# EAGLE design rainbow-gizmo-v2.0 (EAGLE 9.6.2)
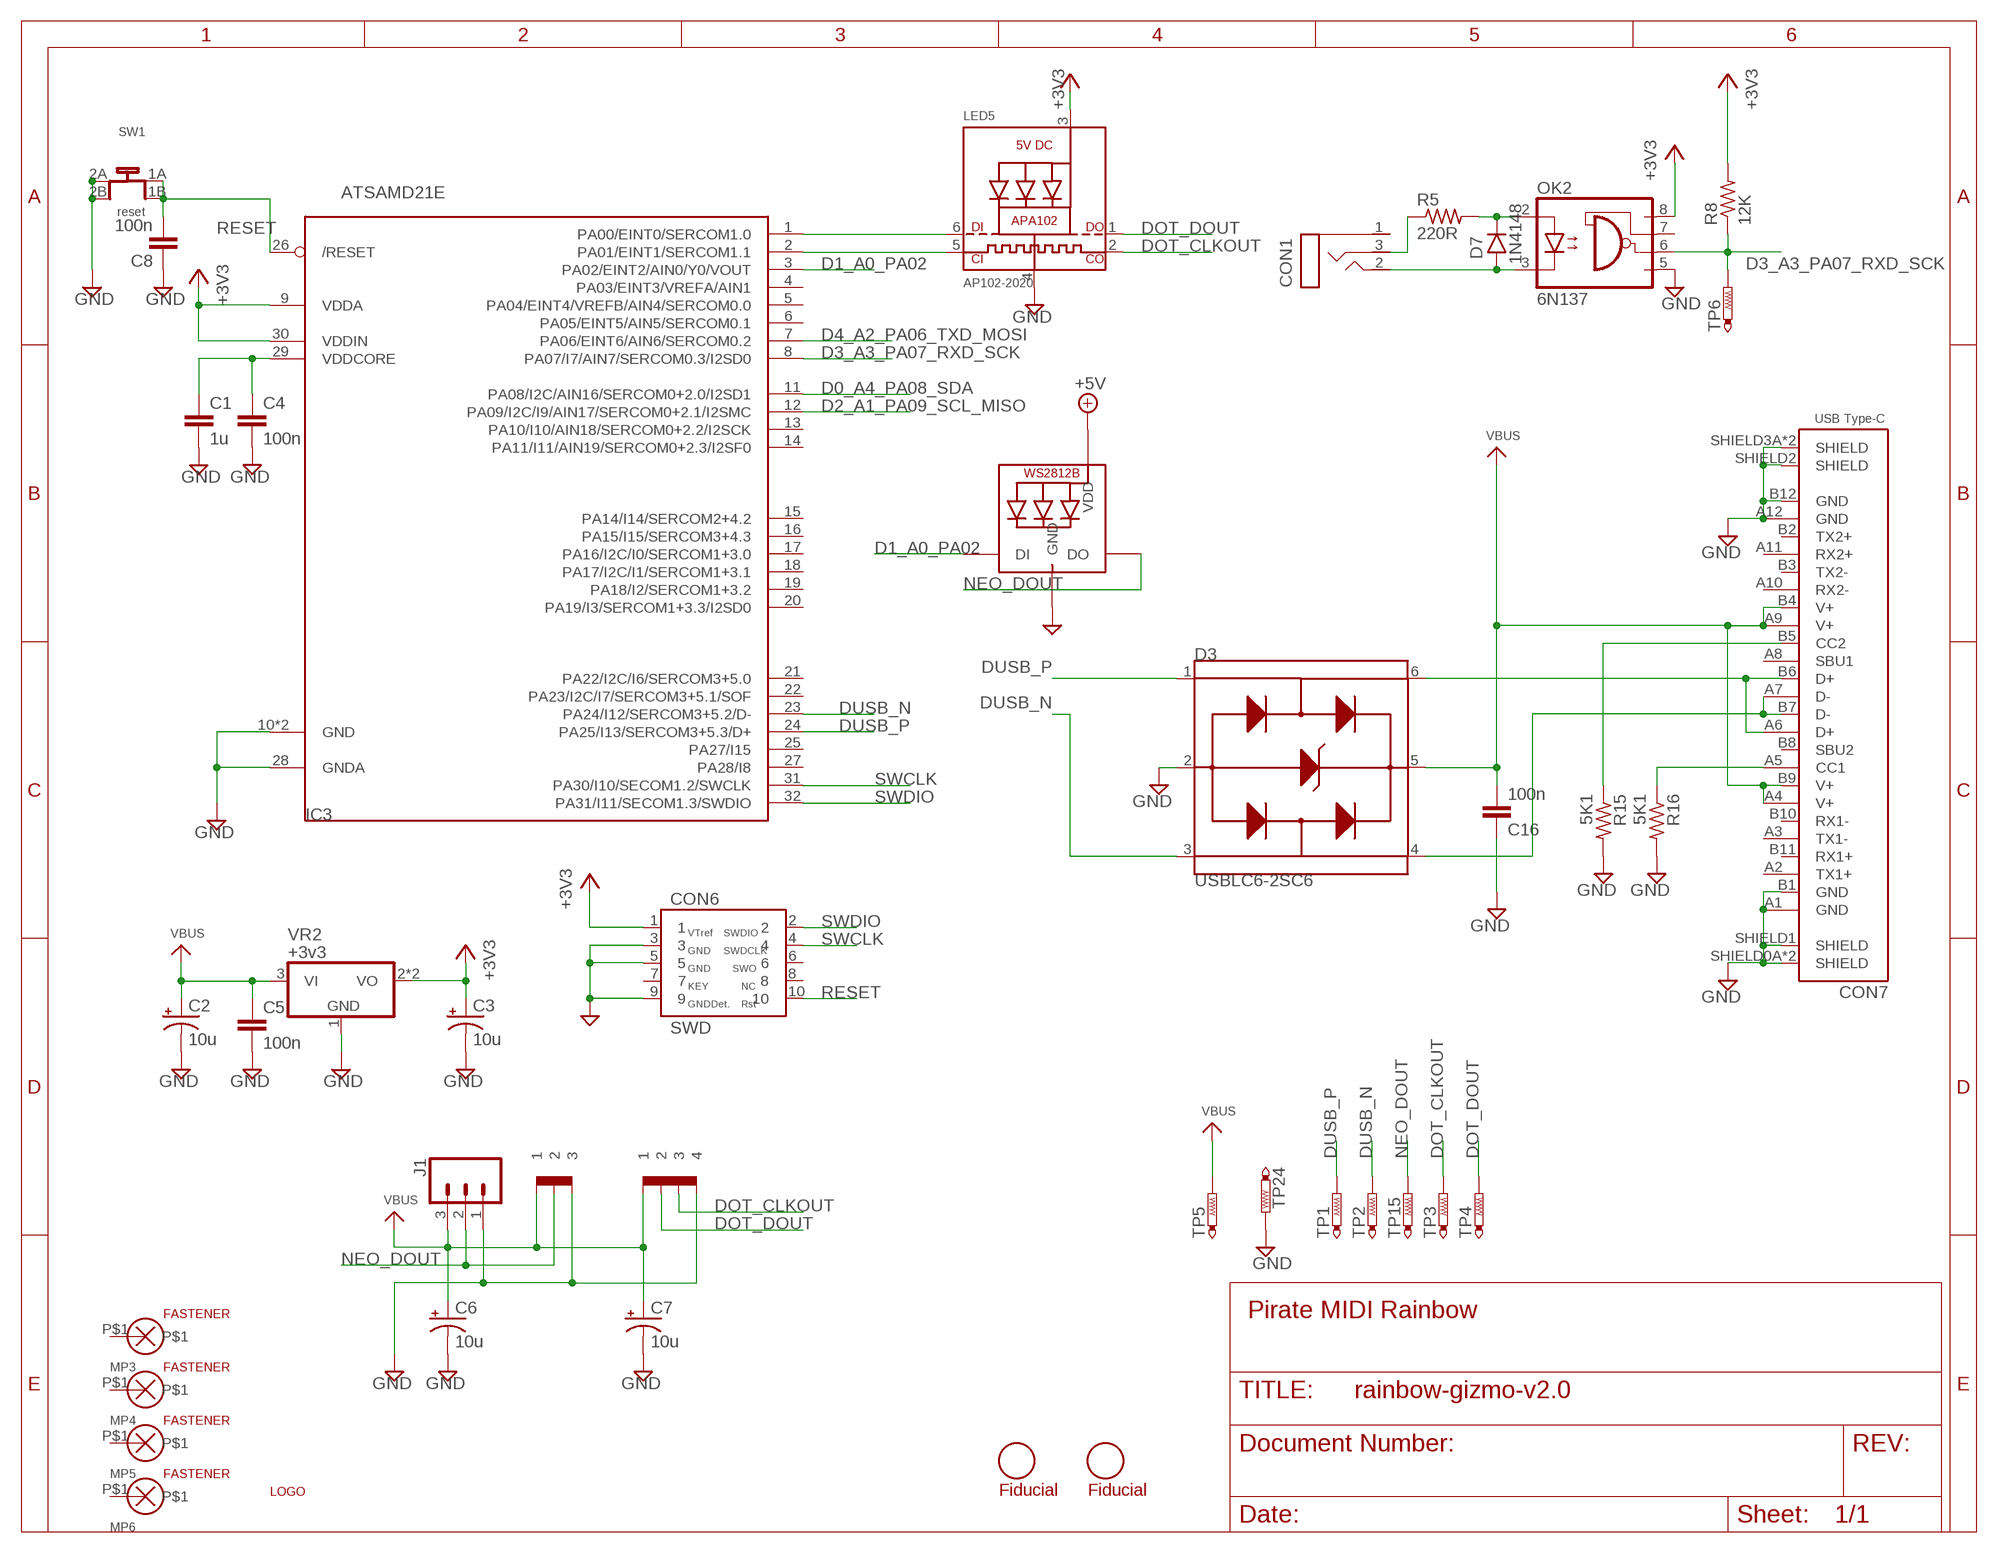
[diagram p0: schematic, sheet 1]

## Parts
C1  1u  SMD-NP0603-1U-H  [0603_CAP]
C2  10u  SMD-ELECTROLYTICB_10U  [PANASONIC_B]
C3  10u  SMD-ELECTROLYTICB_10U  [PANASONIC_B]
C4  100n  SMD-NP0603-100N-H  [0603_CAP]
C5  100n  SMD-NP0603-100N-H  [0603_CAP]
C6  10u  SMD-ELECTROLYTICB_10U  [PANASONIC_B]
C7  10u  SMD-ELECTROLYTICB_10U  [PANASONIC_B]
C8  100n  SMD-NP0603-100N-H  [0603_CAP]
C16  100n  SMD-NP0603-100N-H  [0603_CAP]
CON1  TRS3.5MM  [SJ-352*-SMT]
CON2  1X3PADS  [1X3_PADS]
CON4  1X4  [1X4_PADS]
CON6  SWD  SWD_CONNECTORSMD  [5X2_1.27MM_SMD]
CON7  DUAL SMT  USB_TYPE-CAMPHENOL  [10137064-00021LF]
D3  USBLC6-2SC6  [SOT95P280X145-6N]
D7  1N4148  [SOD-323]
FD3  FIDUCIALSQUARE_1MM  [FIDUCIAL_SQUARE_1MM]
FD4  FIDUCIALROUND_1MM  [FIDUCIAL_ROUND_1MM]
IC3  ATSAMD21E  [QFN32_5MM]
J1  1X3PH  [JST_S3B-PH-SM4-TB]
LED1  WS2812B2020  [LED2020RGB]
LED5  AP102-2020  APA1022020  [APA102_2020]
MP3  SCREW-FASTENER2.5  [M2.5-PANHEAD-VIA]
MP4  SCREW-FASTENER2.5  [M2.5-PANHEAD-VIA]
MP5  SCREW-FASTENER2.5  [M2.5-PANHEAD-VIA]
MP6  SCREW-FASTENER2.5  [M2.5-PANHEAD-VIA]
OK2  6N137  6N137S  [SMD8]
R5  220R  US0603-220R  [0603-RES]
R8  12K  US0603-12K  [0603-RES]
R15  5K1  US0603-5K1  [0603-RES]
R16  5K1  US0603-5K1  [0603-RES]
SW1  reset  MOMENTARYKRM_X  [KMR_X]
TP1  PTR1B1,27  [B1,27]
TP2  PTR1B1,27  [B1,27]
TP3  PTR1B1,27  [B1,27]
TP4  PTR1B1,27  [B1,27]
TP5  PTR1B1,27  [B1,27]
TP6  PTR1B1,27  [B1,27]
TP15  PTR1B1,27  [B1,27]
TP24  PTR1B1,27  [B1,27]
U$5  PM_LOGOSSTOP_M  [PM_M_MAIN_LOGO1_STOP]
VR2  +3v3  LD1117  [SOT223]

## Nets
+3V3: C3.+ CON6.1 IC3.9(VDDA) IC3.30(VDDIN) LED5.3(VDD) OK2.8(VCC) R8.2 VR2.2(VO) VR2.4(VO)
+5V: LED1.4(VDD)
A3: IC3.1(PA00/EINT0/SERCOM1.0) LED5.6(DI)
CC1: CON7.A5(CC1) R16.1
CC2: CON7.B5(CC2) R15.1
D0_A4_PA08_SDA: IC3.11(PA08/I2C/AIN16/SERCOM0+2.0/I2SD1)
D1_A0_PA02: IC3.3(PA02/EINT2/AIN0/Y0/VOUT) LED1.3(DI)
D2_A1_PA09_SCL_MISO: IC3.12(PA09/I2C/I9/AIN17/SERCOM0+2.1/I2SMC)
D3_A3_PA07_RXD_SCK: IC3.8(PA07/I7/AIN7/SERCOM0.3/I2SD0) OK2.6(VO) R8.1 TP6.TP
D4_A2_PA06_TXD_MOSI: IC3.7(PA06/EINT6/AIN6/SERCOM0.2)
DOT_CLKOUT: CON4.P$3 LED5.2(CKO) TP3.TP
DOT_DOUT: CON4.P$2 LED5.1(DO) TP4.TP
DUSB_N [diff pairs]: D3.3(I/O2) IC3.23(PA24/I12/SERCOM3+5.2/D-) TP2.TP
DUSB_P [diff pairs]: D3.1(I/O1) IC3.24(PA25/I13/SERCOM3+5.3/D+) TP1.TP
GND: C1.2 C2.- C3.- C4.2 C5.2 C6.- C7.- C8.1 C16.1 CON2.P$3 CON4.P$4 CON6.3 CON6.5 CON6.9 CON7.A1(GND) CON7.A12(GND) CON7.B1(GND) CON7.B12(GND) CON7.SHIELD0A(SHIELD) CON7.SHIELD0B(SHIELD) CON7.SHIELD1(SHIELD) CON7.SHIELD2(SHIELD) CON7.SHIELD3A(SHIELD) CON7.SHIELD3B(SHIELD) D3.2(GND) IC3.10(GND) IC3.28(GNDA) IC3.33(GND) J1.1 LED1.2(GND) LED5.4(GND) OK2.5(GND) R15.2 R16.2 SW1.2A SW1.2B TP24.TP VR2.1(GND)
N$7: CON1.2(T) D7.A OK2.3(C)
N$8: IC3.2(PA01/EINT1/SERCOM1.1) LED5.5(CKI)
N$9: D7.C OK2.2(A) R5.2
N$10: CON1.3(R) R5.1
N$30: CON7.A6(D+) CON7.B6(D+) D3.6(I/O3)
N$31: CON7.A7(D-) CON7.B7(D-) D3.4(I/O4)
NEO_DOUT: CON2.P$2 J1.2 LED1.1(DO) TP15.TP
RESET: C8.2 CON6.10 IC3.26(/RESET) SW1.1A SW1.1B
SWCLK: CON6.4 IC3.31(PA30/I10/SECOM1.2/SWCLK)
SWDIO: CON6.2 IC3.32(PA31/I11/SECOM1.3/SWDIO)
VBUS: C2.+ C5.1 C6.+ C7.+ C16.2 CON2.P$1 CON4.P$1 CON7.A4(V+) CON7.A9(V+) CON7.B4(V+) CON7.B9(V+) D3.5(VBUS) J1.3 TP5.TP VR2.3(VI)
VDDCORE1: C1.1 C4.1 IC3.29(VDDCORE)
Unconnected: CON1.1(S) CON6.6 CON6.7 CON6.8 CON7.A2(TX1+) CON7.A3(TX1-) CON7.A8(SBU1) CON7.A10(RX2-) CON7.A11(RX2+) CON7.B2(TX2+) CON7.B3(TX2-) CON7.B8(SBU2) CON7.B10(RX1-) CON7.B11(RX1+) IC3.4(PA03/EINT3/VREFA/AIN1) IC3.5(PA04/EINT4/VREFB/AIN4/SERCOM0.0) IC3.6(PA05/EINT5/AIN5/SERCOM0.1) IC3.13(PA10/I10/AIN18/SERCOM0+2.2/I2SCK) IC3.14(PA11/I11/AIN19/SERCOM0+2.3/I2SF0) IC3.15(PA14/I14/SERCOM2+4.2) IC3.16(PA15/I15/SERCOM3+4.3) IC3.17(PA16/I2C/I0/SERCOM1+3.0) IC3.18(PA17/I2C/I1/SERCOM1+3.1) IC3.19(PA18/I2/SERCOM1+3.2) IC3.20(PA19/I3/SERCOM1+3.3/I2SD0) IC3.21(PA22/I2C/I6/SERCOM3+5.0) IC3.22(PA23/I2C/I7/SERCOM3+5.1/SOF) IC3.25(PA27/I15) IC3.27(PA28/I8) MP3.P$1 MP4.P$1 MP5.P$1 MP6.P$1 OK2.7(VE)

## Notes on the sheet
- Pirate MIDI Rainbow

## Library data of the parts
C1 = SPENCER Capacitors:SMD-NP: General usage non-polarized capacitors. House parts are denoted with suffic 'H'.; DIELECTRIC: X5R; MANUFACTURER: YAGEO; PART_NO: CC0603KRX5R8BB105; SUPPLIER: MOUSER; TOLERANCE: 10%; VOLTAGE: 25V
C2 C3 C6 C7 = SPENCER Capacitors:SMD-ELECTROLYTIC; MANUFACTURER: PANASONIC; PART_NO: EEE-HB1E100AR; SUPPLIER: MOUSER
C4 C5 C8 C16 = SPENCER Capacitors:SMD-NP: General usage non-polarized capacitors. House parts are denoted with suffic 'H'.; DIELECTRIC: X7R; MANUFACTURER: TDK; PART_NO: CGA3E2X7R1H104K080AA; SUPPLIER: MOUSER; TOLERANCE: 10%; VOLTAGE: 50V
CON1 = SPENCER Connectors:TRS; MANUFACTURER: CUI; PART_NO: SJ-3523-SMT-TR; SUPPLIER: MOUSER
CON2 = SPENCER. Headers:1X3: Header pins suitable for both male and female headers with 0.1" pin spacing.
CON4 = SPENCER. Headers:1X4: Header pins suitable for both male and female headers with 0.1" pin spacing.
CON6 = SPENCER Connectors:SWD_CONNECTOR; MANUFACTURER: HARWIN; PART_NO: M50-3600542R; SUPPLIER: MOUSER
CON7 = SPENCER Connectors:USB_TYPE-C: JAE DX07S024JJ2 USB Type-C Connector ***Footprint contains plated drill holes (2mm diameter) instead of plated slots (easier on fabhouse)*** Technical Specifications: Mating cycles: 10,000 times Contact resistance: 40mΩ (max.) Rated current: 1.25A (max.) on pins A1, A4, A9, A12, B1, B4, B5, B9 and B12 0.25A (max.) on others Rated voltage: 20Vrms Datasheet <https://www.jae.com/z-en/pdf_download_exec.cfm?param=MB-0297-3E_DX07.pdf> Digi-Key part #: 670-2794-6-ND <http://www.digikey.com/product-detail/en/jae-electronics/DX07S024JJ2R1300/670-2794-6-ND/5246069> Mouser part #: 656-DX07S024JJ2R1300 <http://ca.mouser.com/ProductDetail/JAE-Electronics/DX07S024JJ2R1300/?qs=%2fha2pyFaduhsAyGD7ZqdDeHjVi4g0c8wrw%252bV08Os%252brQ5DqW1EY3Lew%3d%3d> Manufacturer part #: DX07S024JJ2R1300; MANUFACTURER: AMPHENOL FCI; PART_NO: 10137064-00021LF; SUPPLIER: MOUSER
D3 = SPENCER. diodes:USBLC6-2SC6: USBLC6 Series 2 Line 6 V Uni / Bi-Directional ESD Protection - SOT-23-6; MANUFACTURER: STMICROELECTRONICS; PART_NO: USBLC6-2SC6; SUPPLIER: MOUSER
D7 = SPENCER. diodes:1N4148: Fast Switching Diode DO-35 glass case a.k.a. 1N914; MANUFACTURER: MICRO COMMERCIAL COMPONENTS; PART_NO: 1N4148WX-TP; SUPPLIER: MOUSER
FD3 FD4 = SPENCER miscellaneous:FIDUCIAL
IC3 = microbuilder:ATSAMD21E
J1 = SPENCER Connectors:1X3: Multi connection point. Often used as Generic Header-pin footprint for 0.1 inch spaced/style header connections On any of the 0.1 inch spaced packages, you can populate with these: Break Away Headers - Straight <https://www.sparkfun.com/products/116> (PRT-00116) Break Away Male Headers - Right Angle <https://www.sparkfun.com/products/553> (PRT-00553) Female Headers <https://www.sparkfun.com/products/115> (PRT-00115) Break Away Headers - Machine Pin <https://www.sparkfun.com/products/117> (PRT-00117) Break Away Female Headers - Swiss Machine Pin <https://www.sparkfun.com/products/743> (PRT-00743) Stackable Header - 3 Pin (Female, 0.1") <https://www.sparkfun.com/products/13875> (PRT-13875) For SCREWTERMINALS and SPRING TERMINALS visit here: Screw Terimnals on SparkFun.com <https://www.sparkfun.com/search/results?term=Screw+Terminals> (5mm/3.5mm/2.54mm spacing) This device is also useful as a general connection point to wire up your design to another part of your project. Our various solder wires solder well into these plated through hole pads. Hook-Up Wire - Assortment (Stranded, 22 AWG) <https://www.sparkfun.com/products/11375> (PRT-11375) Hook-Up Wire - Assortment (Solid Core, 22 AWG) <https://www.sparkfun.com/products/11367> (PRT-11367) View the entire wire category on our website here <https://www.sparkfun.com/categories/141> Special notes: Molex polarized connector foot print use with SKU : PRT-08232 with associated crimp pins and housings.
LED1 = SPENCER. diodes:WS2812B; MANUFACTURER: WORLDSEMI; PART_NO: WS2812B-2020; SUPPLIER: TME
LED5 = SPENCER. diodes:APA102: APA102/DotStar Pixels VCC: 5V DC Refresh Rate: 400Hz
MP3-MP6 = SPENCER miscellaneous:SCREW-FASTENER
OK2 = SPENCER. ics:6N137: MOTOROLA OPTO COUPLER; MANUFACTURER: LITE-ON; PART_NO: 6N137S; SUPPLIER: MOUSER
R5 = SPENCER. resistors:US: Standard resistor package for most 1/4W (6mm) resistors. Suitable for both carbon and metal film type resistors. Package layouts vary between 1-6 0.1" hole spacings.; MANUFACTURER: YAGEO; PART_NO: RC0603FR-07220RL; SUPPLIER: MOUSER
R8 = SPENCER. resistors:US: Standard resistor package for most 1/4W (6mm) resistors. Suitable for both carbon and metal film type resistors. Package layouts vary between 1-6 0.1" hole spacings.; MANUFACTURER: YAGEO; PART_NO: RC0603FR-0712KL; SUPPLIER: MOUSER
R15 R16 = SPENCER. resistors:US: Standard resistor package for most 1/4W (6mm) resistors. Suitable for both carbon and metal film type resistors. Package layouts vary between 1-6 0.1" hole spacings.; MANUFACTURER: YAGEO; PART_NO: RC0603FR-075K1L; SUPPLIER: MOUSER
SW1 = SPENCER. Switches:MOMENTARY: Tactile push buttons used in millions of devices. Pins 1 and 2 are always connected, and pins 3 and 4 are always connected. Switching occurs between 1/2 and 3/4.; MANUFACTURER: C&K; PART_NO: KMR621NGLFS; SUPPLIER: MOUSER
TP1-TP6 TP15 TP24 = SPENCER testpad:PTR1: TEST PIN
U$5 = SPENCER logos:PM_LOGOS
VR2 = SPENCER. regulators_converters:LD1117; MANUFACTURER: STMICROELECTRONICS; PART_NO: LD1117S33CTR; SUPPLIER: MOUSER

## Net classes
1 differential: width 0.203 mm
2 diff pairs: width 0.203 mm

## Board
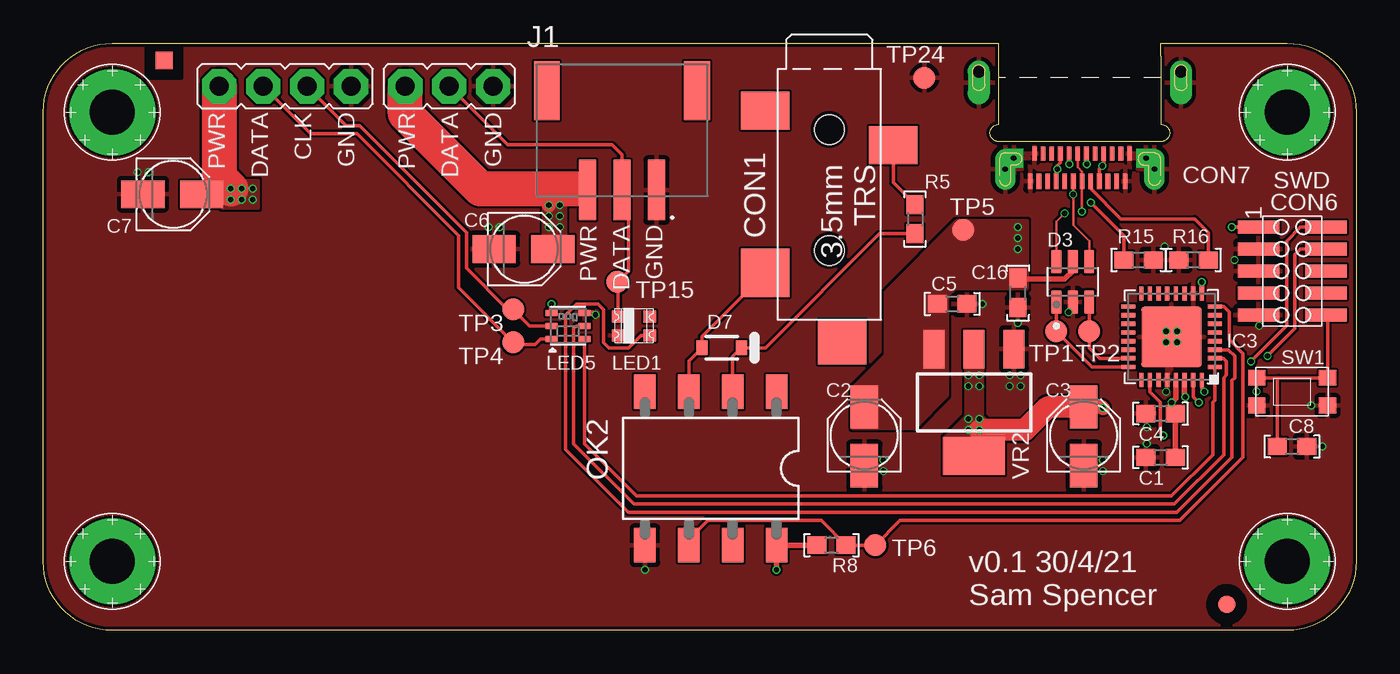
[diagram p1: board, top side]
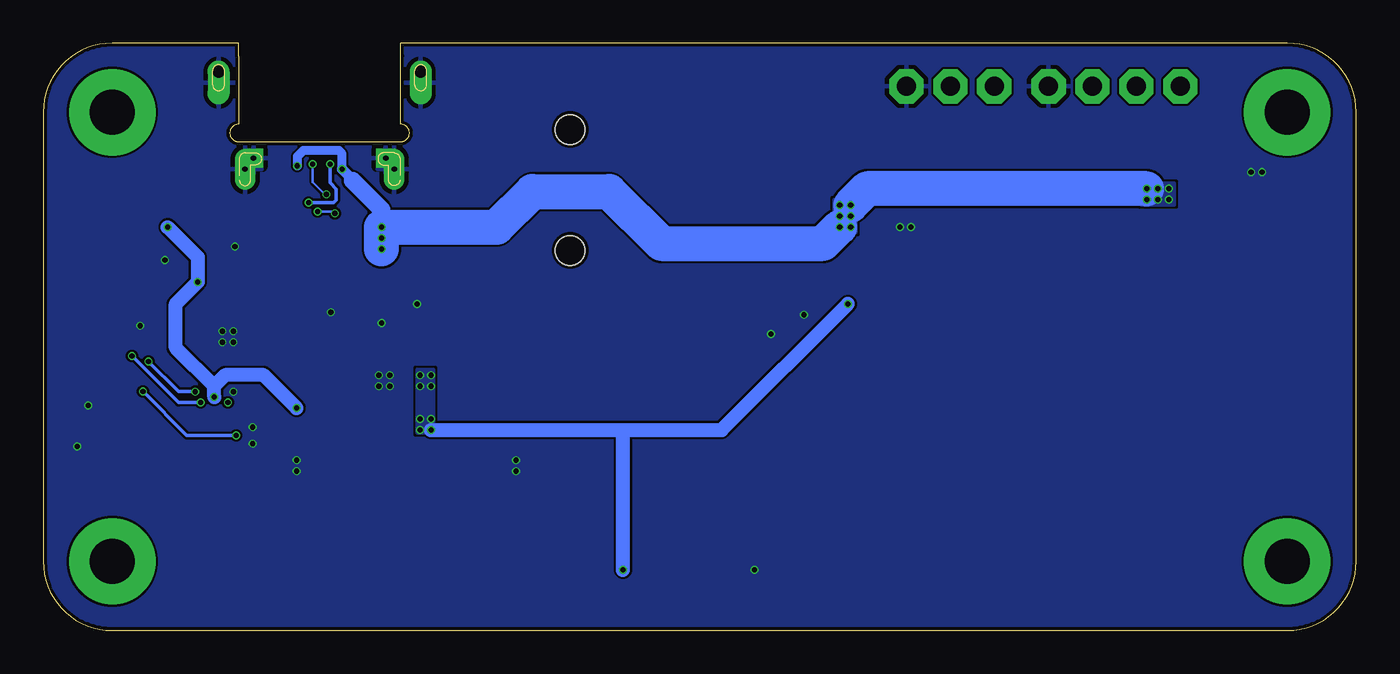
[diagram p2: board, bottom side, seen from below]

Size 76 x 34 mm. Coordinates in mm from the lower left corner, seen from the top.
Outline: 55.3,33.25 55.3,34 4,34 arc90 0,30 0,4 arc90 4,0 72,0 arc90 76,4 76,30 arc90 72,34 64.7,34 64.7,33.25
Copper layers (1*16): Top 0.035mm / dielectric 1.6mm / Bottom 0.035mm
Design rules "jlcpcb-2layers-new *": minimum track width 5mil, minimum drill 0.3mm, track to track 5mil, track to pad 5mil, pad to pad 5mil, via to via 5mil, smd to smd 0mil, copper to edge 0.2mm, drill to drill 6mil, minimum pad ring 10mil, minimum via ring 3mil, stop-mask expansion 4mil, vias tented up to drill 0mil, thermal gap 10mil

### Footprints (pad centres in the part's own frame; a part is rotated, then mirrored left to right if it is on the bottom)
0603_CAP = smd 1.1 x 1: 1 -0.85,0; 2 0.85,0
PANASONIC_B = smd 2.5 x 1.6: + 1.65,0; - -1.75,0
SJ-352*-SMT = smd 2.2 x 2.8: 1 -4.1,-3.7; 3 -2.1,3.7 | smd 2.8 x 2.8: 2 5.3,-3.7 | smd 2.6 x 2.8: 4 9.3,0.75 | hole 1.7: -3,0; 4,0
1X3_PADS = drill 1.1 octagon: P$1 -2.54,0; P$2 0,0; P$3 2.54,0
1X4_PADS = drill 1.1 octagon: P$1 -3.81,0; P$2 -1.27,0; P$3 1.27,0; P$4 3.81,0
5X2_1.27MM_SMD = smd 0.75 x 2.4: 1 -2.54,-1.95; 2 -2.54,1.95; 3 -1.27,-1.95; 4 -1.27,1.95; 5 0,-1.95; 6 0,1.95; 7 1.27,-1.95; 8 1.27,1.95; 9 2.54,-1.95; 10 2.54,1.95
10137064-00021LF = smd 0.27 x 0.9: A1 -2.625,5.995; A2 -2.125,5.995; A3 -1.625,5.995; A4 -1.125,5.995; A5 -0.625,5.995; A6 -0.125,5.995; A7 0.375,5.995; A8 0.875,5.995; A9 1.375,5.995; A10 1.875,5.995; A11 2.375,5.995; A12 2.875,5.995 | smd 0.27 x 0.8: B1 2.625,4.4; B2 2.125,4.4; B3 1.625,4.4; B4 1.125,4.4; B5 0.625,4.4; B6 0.125,4.4; B7 -0.375,4.4; B8 -0.875,4.4; B9 -1.375,4.4; B10 -1.875,4.4; B11 -2.375,4.4; B12 -2.875,4.4 | drill 0.3 pad 1.2 long: SHIELD0A -4.32,5.3; SHIELD3A 4.32,5.3 | drill 0.3 pad 1.1 square: SHIELD0B -3.83,4.65; SHIELD3B 3.83,4.65 | drill 0.7 offset: SHIELD1 -5.85,-0.35; SHIELD2 5.85,-0.35
SOT95P280X145-6N = smd 1.36 x 0.6: 1 -1.175,0.95; 2 -1.175,0; 3 -1.175,-0.95; 4 1.175,-0.95; 5 1.175,0; 6 1.175,0.95
SOD-323 = smd 0.63 x 0.83: A 1.15,0; C -1.15,0
FIDUCIAL_SQUARE_1MM = smd 1 x 1: 1 0,0
FIDUCIAL_ROUND_1MM = smd 1 x 1: 1 0,0
QFN32_5MM = smd 0.8 x 0.25: 1 -2.5,1.75; 2 -2.5,1.25; 3 -2.5,0.75; 4 -2.5,0.25; 5 -2.5,-0.25; 6 -2.5,-0.75; 7 -2.5,-1.25; 8 -2.5,-1.75; 17 2.5,-1.75; 18 2.5,-1.25; 19 2.5,-0.75; 20 2.5,-0.25; 21 2.5,0.25; 22 2.5,0.75; 23 2.5,1.25; 24 2.5,1.75 | smd 0.25 x 0.8: 9 -1.75,-2.5; 10 -1.25,-2.5; 11 -0.75,-2.5; 12 -0.25,-2.5; 13 0.25,-2.5; 14 0.75,-2.5; 15 1.25,-2.5; 16 1.75,-2.5; 25 1.75,2.5; 26 1.25,2.5; 27 0.75,2.5; 28 0.25,2.5; 29 -0.25,2.5; 30 -0.75,2.5; 31 -1.25,2.5; 32 -1.75,2.5 | smd 3.5 x 3.5: 33 0,0
JST_S3B-PH-SM4-TB = smd 1 x 3.5: 1 2,0; 2 0,0; 3 -2,0 | smd 1.5 x 3.4: P1 4.35,5.75; P2 -4.35,5.75
LED2020RGB = smd 0.7 x 0.7: 1 0.915,-0.55; 2 0.915,0.55; 3 -0.915,0.55; 4 -0.915,-0.55
APA102_2020 = smd 0.7 x 0.35: 1 -0.95,-0.75; 2 -0.95,0; 3 -0.95,0.75; 4 0.95,0.75; 5 0.95,0; 6 0.95,-0.75
M2.5-PANHEAD-VIA = drill 2.6 pad 5: P$1 0,0
SMD8 = smd 1.25 x 2: 1 -3.81,-4.445; 2 -1.27,-4.445; 3 1.27,-4.445; 4 3.81,-4.445; 5 3.81,4.445; 6 1.27,4.445; 7 -1.27,4.445; 8 -3.81,4.445
0603-RES = smd 1.1 x 1: 1 -0.85,0; 2 0.85,0
KMR_X = smd 1 x 0.9: 1A -2.05,-0.8; 1B 2.05,-0.8; 2A -2.05,0.8; 2B 2.05,0.8
B1,27 = smd 1.27 x 1.27: TP 0,0
SOT223 = smd 1.219 x 2.235: 1 -2.311,-3.099; 2 0,-3.099; 3 2.311,-3.099 | smd 3.6 x 2.2: 4 0,3.099

### Placement (x,y rotation side)
C1  64.67,10.02 180 top
C2  47.52,11.29 90 top
C3  60.23,11.29 90 top
C4  64.67,12.55 180 top
C5  52.61,18.91 0 top
C6  27.84,22.08 0 top
C7  7.52,25.26 0 top
C8  72.29,10.65 180 top
C16  56.41,19.54 90 top
CON1  45.5,26 270 top
CON2  23.5,31.5 0 top
CON4  14,31.5 0 top
CON6  72.29,20.81 270 top
CON7  60,32 180 top
D3  59.59,20.18 90 top
D7  39.27,16.36 180 top
FD3  7,33 0 top
FD4  68.5,1.5 0 top
IC3  65.31,17 180 top
J1  33.5,25.5 0 top
LED1  34.19,17.64 180 top
LED5  30.38,17.64 0 top
MP3  4,30 0 top
MP4  72,30 0 top
MP5  72,4 0 top
MP6  4,4 0 top
OK2  38.63,9.38 180 top
R5  50.45,23.82 270 top
R8  45.62,4.94 180 top
R15  63.4,21.45 0 top
R16  66.58,21.45 180 top
SW1  72.29,13.82 180 top
TP1  58.64,17.32 0 top
TP2  60.54,17.32 0 top
TP3  27.2,18.59 0 top
TP4  27.2,16.68 0 top
TP5  53.24,23.19 0 top
TP6  48.16,4.94 0 top
TP15  33.24,20.18 0 top
TP24  51,32 0 top
U$5  12,15 0 top
VR2  53.88,13.19 180 top

### Tracks (layer width: path | path; a pad name or v marks a point on that pad's centre or on a via)
+3V3  (via drill 0.3)
  Top 0.203: v68.8,23.35 CON6.1
  Top 0.305: R8.2 OK2.8 v42.45,3.51 | v66.1,13.51 66.06,13.55 IC3.30 | IC3.9 v67.05,20.18 | LED5.3 v29.43,18.91
  Top 0.813: v61.34,12.87 61.27,12.93 C3.+
  Top 1.27: C3.+ 58.16,12.93 56.83,11.6 v54.19,11.6
  Bottom 0.813: v68.8,23.35 67.05,21.6 v67.05,20.18 68.32,18.91 68.32,16.36 66.1,14.14 | v66.1,13.51 66.1,14.14 | 66.1,14.14 65.46,14.78 63.24,14.78 v61.34,12.87 | v53.56,11.6 42.45,11.6 | 42.45,11.6 36.73,11.6 v29.43,18.91 | v42.45,3.51 42.45,11.6
  other vias: 54.19,12.24 53.56,12.24 53.56,14.78 54.19,14.78 54.19,14.14 53.56,14.14
  pour Top (no thermals): 53.4,15.25 53.4,12.4 52.13,11.13 55.62,11.13 54.35,12.4 54.35,15.25
  pour Bottom (no thermals): 54.35,15.1 54.35,11.44 53.4,11.44 53.4,15.1
A3
  Top 0.203: IC3.1 67.81,13.31 67.69,13.19 67.69,10.17 65.31,7.79 34.35,7.79 31.33,10.81 LED5.6
CC1
  Top 0.203: CON7.A5 60.62,25.57 62.38,23.82 66.65,23.82 67.42,23.04 R16.1
CC2  (via drill 0.3)
  Top 0.152: CON7.B5 59.38,27.11 59.4,27.09 v59.4,27
  Top 0.203: v60.63,24.77 62.55,22.85 R15.1
  Bottom 0.203: v59.4,27 59.4,25.92 59.05,25.56 59.05,24.93 59.2,24.77 v60.63,24.77
D1_A0_PA02
  Top 0.203: IC3.3 68.59,16.25 68.96,15.89 68.96,14.62 68.8,14.46 68.8,10.02 65.62,6.84 33.87,6.84 30.22,10.49 30.22,18.27 30.86,18.91 32.13,18.91 32.44,18.59 32.44,16.68 32.76,16.36 33.87,16.36 34.59,17.09 LED1.3
D3_A3_PA07_RXD_SCK
  Top 0.203: OK2.6 37.37,5.25 38.48,6.36 45.04,6.36 R8.1 TP6.TP 49.59,6.36 65.78,6.36 69.43,10.02 69.43,16.05 68.64,16.84 68.64,18.43 68.32,18.75 IC3.8
DOT_CLKOUT
  Top 0.203: LED5.2 28.16,17.64 TP3.TP 26.89,18.59 24.51,20.97 24.51,23.03 18.32,29.22 17.52,29.22 15.27,31.48 CON4.P$3
DOT_DOUT
  Top 0.203: LED5.1 28.8,16.89 28.48,16.57 27.32,16.57 TP4.TP 24.03,19.86 24.03,22.87 18.16,28.75 15.48,28.75 CON4.P$2
DUSB_N
  Top 0.203: D3.3 TP2.TP 60.54,16.36 61.16,15.75 IC3.23
DUSB_P
  Top 0.203: D3.1 TP1.TP 60.46,15.5 60.7,15.25 IC3.24
GND  (via drill 0.3)
  Top 0.305: LED5.4 31.85,18.39 v31.97,18.27
  other vias: 64.9,22.23 56.41,17.79 59.34,18.42 63.88,11.76 63.88,10.81 61.34,9.86 61.34,9.22 48.64,9.22 48.64,9.86 34.83,3.51 64.99,13.82 54.35,18.91 55.94,14.78 56.57,14.78 56.57,14.14 55.94,14.14 74.04,10.65 73.4,13.03 5.46,26.52 6.09,26.52 26.41,23.35 25.78,23.35 64.99,17.32 65.62,17.32 65.62,16.68 64.99,16.68 68.96,21.45 70.38,17.64 33.87,17.16
  pour Top (isolate 0.127, rank 5): 0,34 76,34 76,0 0,0
  pour Bottom (isolate 0.127, rank 5): 0,34 0,0 76,0 76,34
N$7
  Top 0.203: OK2.3 37.37,15.61 D7.A 38.12,17.02 CON1.2
N$8
  Top 0.203: IC3.2 68.3,15.75 68.48,15.57 68.48,14.78 68.32,14.62 68.32,10.17 65.46,7.32 34.19,7.32 30.7,10.81 30.7,17.48 30.86,17.64 LED5.5
N$9
  Top 0.203: OK2.2 39.91,15.85 D7.C 41.81,16.36 48.41,22.96 R5.2
N$10
  Top 0.203: R5.1 49.2,25.92 CON1.3
N$30  (via drill 0.3)
  Top 0.152: v60.11,24.25 60.12,24.26 CON7.A6 60.12,26.56 59.88,26.81 CON7.B6 | v59.11,24.14 58.64,23.67 D3.6
  Bottom 0.152: v60.11,24.25 59.16,24.25 59.19,24.22 v59.11,24.14
N$31  (via drill 0.3)
  Top 0.152: CON7.B7 60.4,27.57 v60.4,27 | CON7.A7 59.62,25.26 v59.61,25.24 59.61,23.48 60.54,22.55 D3.4
  Bottom 0.152: v60.4,27 60.4,25.96 59.68,25.24 v59.61,25.24
NEO_DOUT
  Top 0.203: LED1.1 33.27,20.14 TP15.TP 33.87,20.81 33.87,23.86 33.5,24.23 J1.2 33.5,27.53 32.92,28.11 26.89,28.11 CON2.P$2
RESET  (via drill 0.3)
  Top 0.203: v64.83,11.29 64.67,11.44 64.67,13.19 64.06,13.8 IC3.26 | 71.5,14.62 SW1.1B 70.23,14.61 v70.23,13.83 | 71.5,14.62 SW1.1A 74.34,18.17 CON6.10 | C8.2 71.44,14.57 71.5,14.62
  Bottom 0.203: v70.23,13.83 v70.23,13.82 67.69,11.29 v64.83,11.29
SWCLK  (via drill 0.3)
  Top 0.203: IC3.31 66.56,13.53 v66.89,13.19 | v70.86,15.89 72.45,17.48 72.45,21.76 72.77,22.08 CON6.4
  Bottom 0.203: v66.89,13.19 68.16,13.19 v70.86,15.89
SWDIO  (via drill 0.3)
  Top 0.203: IC3.32 67.06,13.98 v67.21,13.82 | v69.91,15.57 71.97,17.64 71.97,22.56 72.77,23.35 CON6.2
  Bottom 0.203: v67.21,13.82 68.16,13.82 v69.91,15.57
VBUS  (via drill 0.3)
  Top 0.203: CON7.B9 61.38,26.98 v61.3,26.9 61.12,26.73 CON7.A4 | CON7.B4 58.88,27.09 58.7,26.91 v58.7,26.7 58.62,26.62 CON7.A9
  Top 0.305: D3.5 59.59,20.81 59.11,20.33 56.47,20.33 C16.2
  Top 0.813: 30.86,25.57 31.43,25.57 J1.3 | v29.27,24.62 29.27,25.57
  Top 2.032: CON2.P$1 20.96,29.91 25.3,25.57 29.27,25.57 30.86,25.57 | CON4.P$1 10.19,26.24 v10.85,25.57
  Bottom 0.508: v58.7,26.7 58.7,27.6 58.89,27.78 60.95,27.78 61.3,27.43 v61.3,26.9
  Bottom 0.61: v58.7,26.7 58.09,26.09 58.09,26.04
  Bottom 1.016: 58.09,26.04 56.41,24.36 v56.41,22.71
  Bottom 2.032: v56.41,22.08 v56.41,22.71 v56.41,23.35 49.75,23.35 47.68,25.41 43.24,25.41 40.22,22.4 30.86,22.4 v29.9,23.35 | v12.12,25.57 28.32,25.57 v29.27,24.62
  other vias: 11.49,25.57 12.12,24.94 11.49,24.94 10.85,24.94 29.27,23.35 29.9,23.98 29.9,24.62 29.27,23.98
  pour Top (no thermals): 56.89,23.67 52.92,23.67 48.8,19.54 48.8,15.89 46.89,13.98 46.89,11.76 50.38,11.76 52.29,13.67 52.29,19.38 52.76,19.86 56.89,19.86
  pour Top (no thermals): 10.38,26.05 12.44,26.05 12.44,24.46 10.38,24.46
  pour Bottom (no thermals): 10.54,25.89 10.54,24.62 12.44,24.62 12.44,25.89
  pour Top (no thermals): 28.95,24.94 28.95,22.87 30.22,22.87 30.22,24.94
  pour Bottom (no thermals): 28.95,24.94 30.22,24.94 30.22,23.03 28.95,23.03
VDDCORE1  (via drill 0.3)
  Top 0.305: IC3.29 65.56,13.44 v65.31,13.19 65.31,12.77 C4.1 C1.1

### Text on the board
tPlace: PWR | DATA | CLK | GND | PWR | DATA | GND | PWR | DATA | GND | v0.1 30/4/21 / Sam Spencer
tStop: Rainbow MIDI